# EAGLE schematic luxeon (EAGLE 5.08)
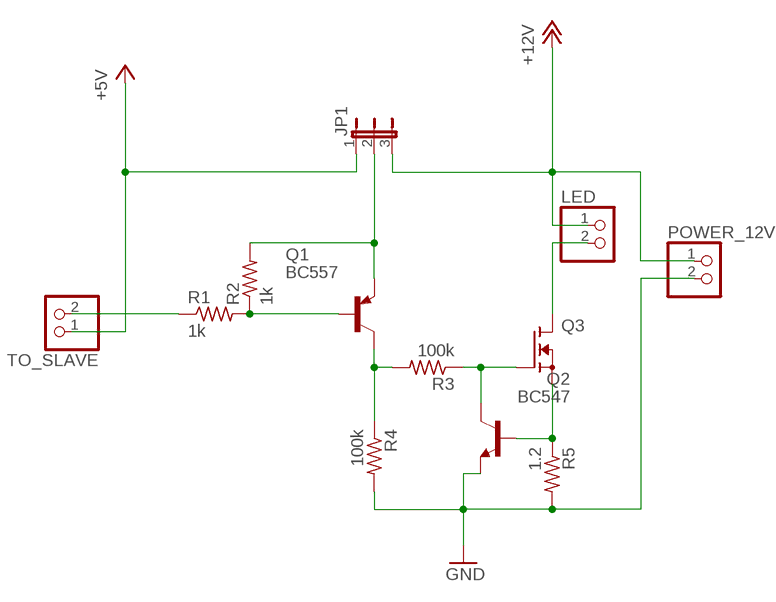
[diagram p0: schematic, sheet 1]

## Parts
JP1  JP2E  [JP2]
LED  PINHD-1X2  [1X02]
POWER_12V  PINHD-1X2  [1X02]
Q1  BC557  [TO92]
Q2  BC547  [TO92]
Q3  TOSHIBA-2SK4033  [TO252]
R1  1k  R-US_0207/2V  [0207/2V]
R2  1k  R-US_0207/2V  [0207/2V]
R3  100k  R-US_0207/2V  [0207/2V]
R4  100k  R-US_0207/2V  [0207/2V]
R5  1.2  R-US_0207/2V  [0207/2V]
TO_SLAVE  PINHD-1X2  [1X02]

## Nets
+5V: JP1.1 TO_SLAVE.1
+12V: JP1.3 LED.1 POWER_12V.1
GND: POWER_12V.2 Q2.1(E) R4.2 R5.2
N$1: Q1.2(B) R1.2 R2.1
N$2: Q2.3(C) Q3.1(G) R3.1
N$3: Q1.3(C) R3.2 R4.1
N$4: Q2.2(B) Q3.2(S) R5.1
N$5: JP1.2 Q1.1(E) R2.2
N$6: R1.1 TO_SLAVE.2
N$7: LED.2 Q3.3(D)

## Library data of the parts
JP1 = jumper:JP2E: JUMPER
LED POWER_12V TO_SLAVE = pinhead:PINHD-1X2: PIN HEADER
Q1 = transistor-pnp:BC557: PNP Transistor
Q2 = transistor:BC547: NPN TRANSISTOR
Q3 = damians_bits:TOSHIBA-2SK4033: TOSHIBA 2SK4033 Field Effect Transistor N-Channel MOSFET
R1-R5 = resistor:R-US_: RESISTOR, American symbol